# EAGLE design ZaraTraining (EAGLE 9.6.2)
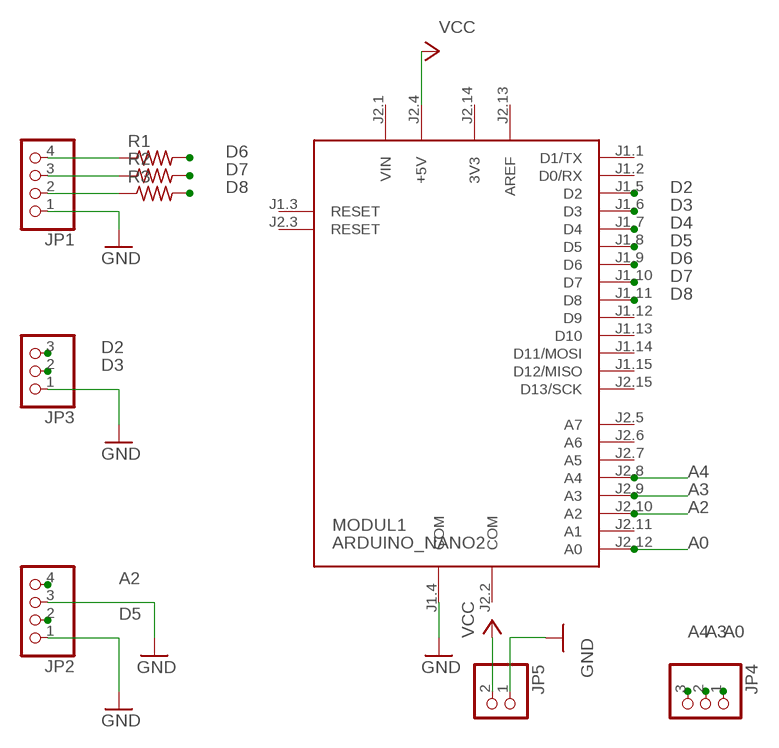
[diagram p0: schematic, sheet 1]

## Parts
JP1  PINHD-1X4  [1X04]
JP2  PINHD-1X4  [1X04]
JP3  PINHD-1X3  [1X03]
JP4  PINHD-1X3  [1X03]
JP5  PINHD-1X2  [1X02]
MODUL1  ARDUINO_NANO2  [ARDUINO_NANO2]
R1  R-US_0204/5  [0204/5]
R2  R-US_0204/5  [0204/5]
R3  R-US_0204/5  [0204/5]

## Nets
A0: JP4.1 MODUL1.J2.12(A0)
A2: JP2.4 MODUL1.J2.10(A2)
A3: JP4.2 MODUL1.J2.9(A3)
A4: JP4.3 MODUL1.J2.8(A4)
D2: JP3.3 MODUL1.J1.5(D2)
D3: JP3.2 MODUL1.J1.6(D3)
D4: MODUL1.J1.7(D4)
D5: JP2.2 MODUL1.J1.8(D5)
D6: MODUL1.J1.9(D6) R1.2
D7: MODUL1.J1.10(D7) R2.2
D8: MODUL1.J1.11(D8) R3.2
GND: JP1.1 JP2.1 JP2.3 JP3.1 JP5.1 MODUL1.J1.4(COM)
N$1: JP1.4 R1.1
N$2: JP1.3 R2.1
N$3: JP1.2 R3.1
VCC: JP5.2 MODUL1.J2.4(+5V)
Unconnected: MODUL1.J1.1(D1/TX) MODUL1.J1.2(D0/RX) MODUL1.J1.3(RESET) MODUL1.J1.12(D9) MODUL1.J1.13(D10) MODUL1.J1.14(D11/MOSI) MODUL1.J1.15(D12/MISO) MODUL1.J2.3(RESET) MODUL1.J2.5(A7) MODUL1.J2.6(A6) MODUL1.J2.7(A5) MODUL1.J2.11(A1) MODUL1.J2.15(D13/SCK)

## Power pins joined to a net without a drawn wire
3V3: MODUL1.J2.14(3V3)
AREF: MODUL1.J2.13(AREF)
COM: MODUL1.J2.2(COM)
VIN: MODUL1.J2.1(VIN)

## Library data of the parts
JP1 JP2 = pinhead:PINHD-1X4: PIN HEADER
JP3 JP4 = pinhead:PINHD-1X3: PIN HEADER
JP5 = pinhead:PINHD-1X2: PIN HEADER
MODUL1 = arduino:ARDUINO_NANO2: Arduino Nano2 Auto generated by modulcreator.ulp \;; ANZAHL: 2; MODUL: TRUE; STECKX0: -76200; STECKX1: 76200; STECKY0: 177800; STECKY1: 177800
R1-R3 = rcl:R-US_: RESISTOR, American symbol; SPICEPREFIX: R

## Board
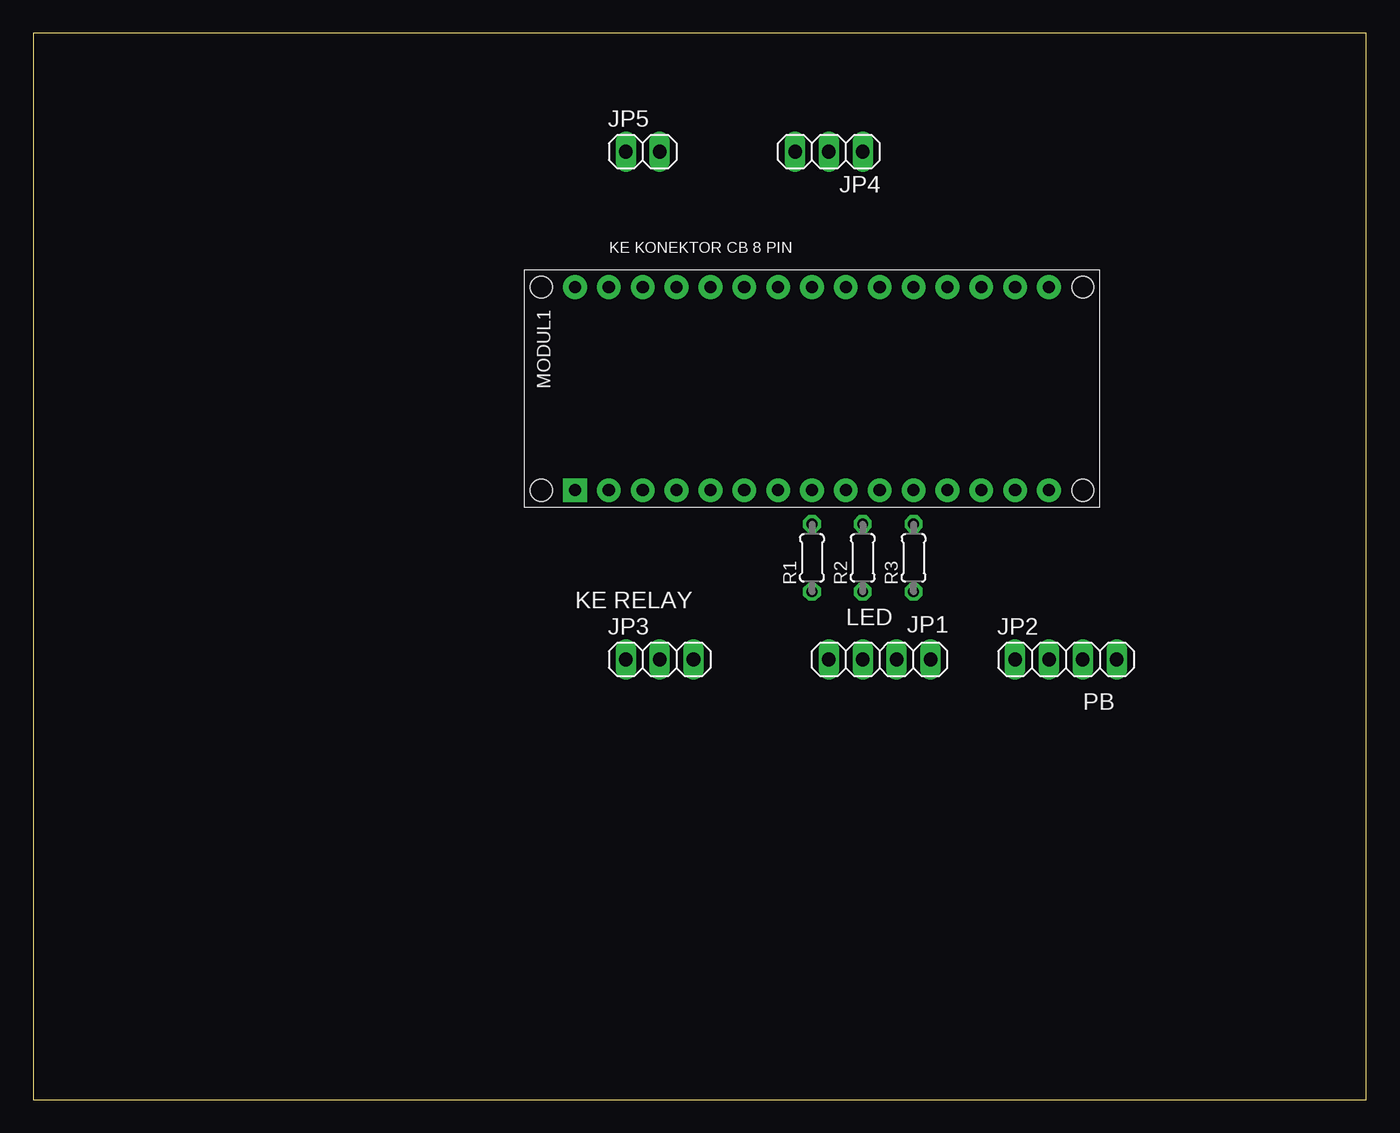
[diagram p1: board, top side]
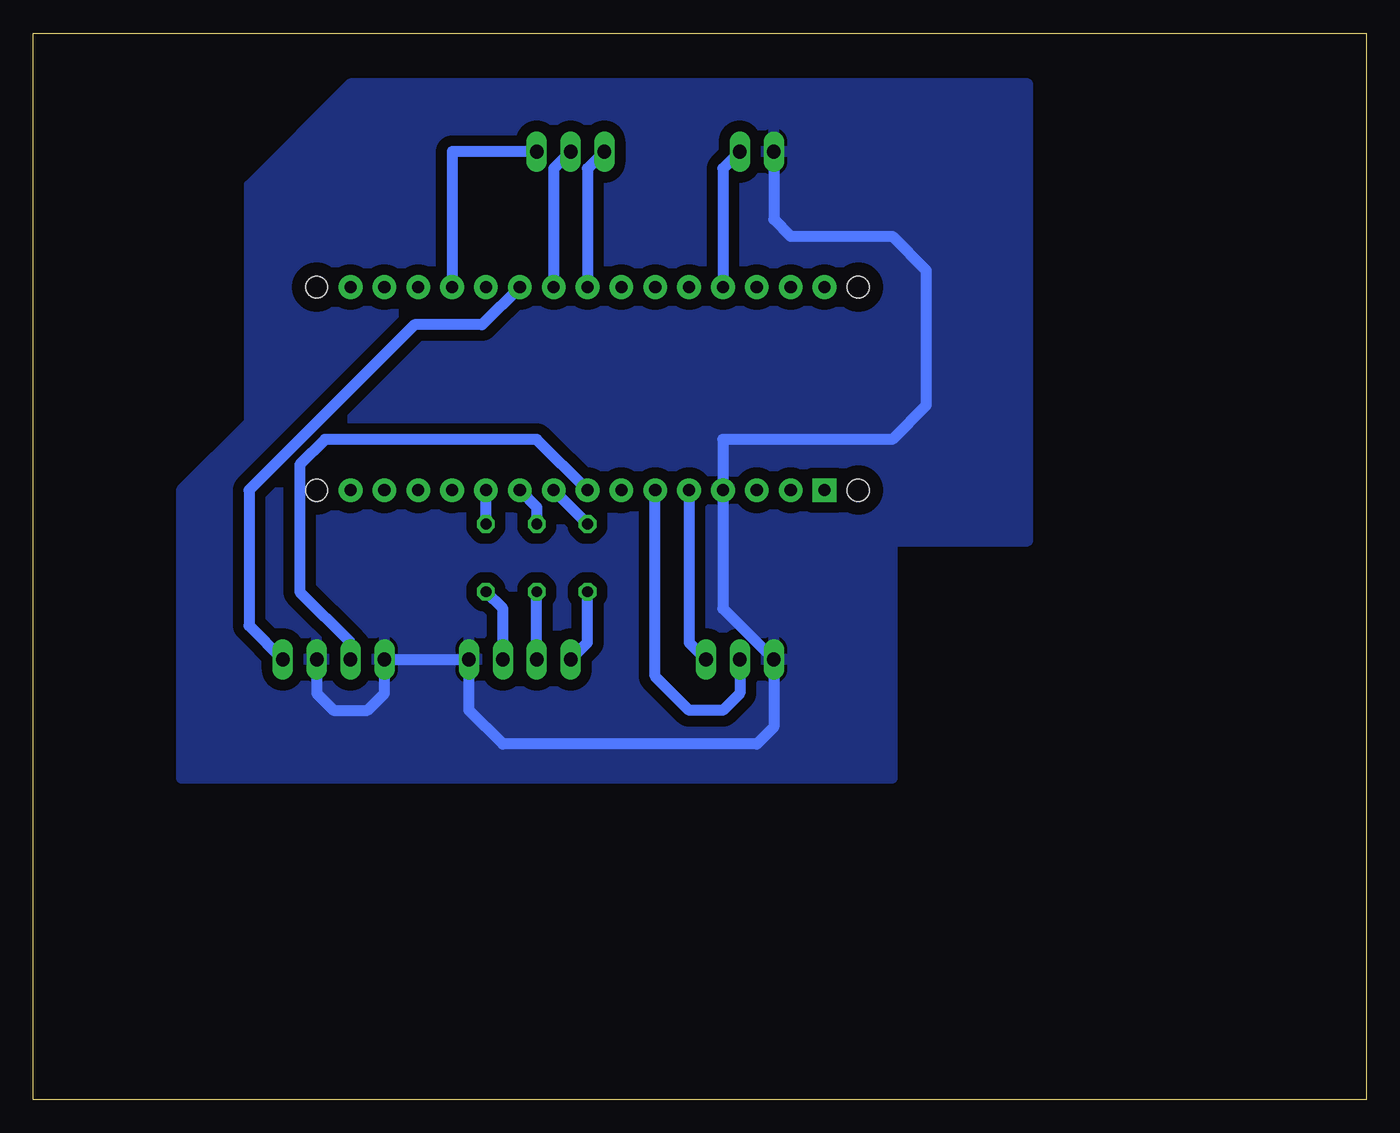
[diagram p2: board, bottom side, seen from below]

Size 100 x 80 mm. Coordinates in mm from the lower left corner, seen from the top.
Outline: 0,0 100,0 100,80 0,80 0,0
Copper layers (1*16): Top 0.035mm / dielectric 1.5mm / Bottom 0.035mm
Design rules "default": minimum track width 6mil, minimum drill 0.35mm, track to track 6mil, track to pad 6mil, pad to pad 6mil, via to via 6mil, smd to smd 6mil, copper to edge 40mil, drill to drill 6mil, minimum pad ring 10mil, minimum via ring 8mil, stop-mask expansion 4mil, vias tented up to drill 0mil, thermal gap 10mil

### Footprints (pad centres in the part's own frame; a part is rotated, then mirrored left to right if it is on the bottom)
1X04 = drill 1.016 long: 1 -3.81,0; 2 -1.27,0; 3 1.27,0; 4 3.81,0
1X03 = drill 1.016 long: 1 -2.54,0; 2 0,0; 3 2.54,0
1X02 = drill 1.016 long: 1 -1.27,0; 2 1.27,0
ARDUINO_NANO2 = drill 0.914 pad 1.778 square: J1.1 -7.62,17.78 | drill 0.914 pad 1.778: J1.2 -7.62,15.24; J1.3 -7.62,12.7; J1.4 -7.62,10.16; J1.5 -7.62,7.62; J1.6 -7.62,5.08; J1.7 -7.62,2.54; J1.8 -7.62,0; J1.9 -7.62,-2.54; J1.10 -7.62,-5.08; J1.11 -7.62,-7.62; J1.12 -7.62,-10.16; J1.13 -7.62,-12.7; J1.14 -7.62,-15.24; J1.15 -7.62,-17.78; J2.1 7.62,17.78; J2.2 7.62,15.24; J2.3 7.62,12.7; J2.4 7.62,10.16; J2.5 7.62,7.62; J2.6 7.62,5.08; J2.7 7.62,2.54; J2.8 7.62,0; J2.9 7.62,-2.54; J2.10 7.62,-5.08; J2.11 7.62,-7.62; J2.12 7.62,-10.16; J2.13 7.62,-12.7; J2.14 7.62,-15.24; J2.15 7.62,-17.78 | hole 1.651: -7.62,-20.32; 7.62,-20.32; 7.62,20.32; -7.62,20.32
0204/5 = drill 0.813 octagon: 1 -2.54,0; 2 2.54,0

### Placement (x,y rotation side)
JP1  63.5,33.02 180 top
JP2  77.47,33.02 0 top
JP3  46.99,33.02 0 top
JP4  59.69,71.12 180 top
JP5  45.72,71.12 0 top
MODUL1  58.42,53.34 90 top
R1  58.42,40.64 90 top
R2  62.23,40.64 90 top
R3  66.04,40.64 90 top

### Tracks (layer width: path | path; a pad name or v marks a point on that pad's centre or on a via)
A0
  Bottom 0.813: JP4.1 68.58,71.12 MODUL1.J2.12
A2
  Bottom 0.813: MODUL1.J2.10 66.33,58.13 71.41,58.13 83.82,45.72 83.82,35.56 JP2.4
A3
  Bottom 0.813: JP4.2 60.96,69.85 MODUL1.J2.9
A4
  Bottom 0.813: JP4.3 58.42,69.85 MODUL1.J2.8
D2
  Bottom 0.813: MODUL1.J1.5 50.8,34.29 JP3.3
D3
  Bottom 0.813: JP3.2 46.99,30.48 48.26,29.21 50.8,29.21 53.34,31.75 MODUL1.J1.6
D5
  Bottom 0.813: MODUL1.J1.8 62.23,49.53 78.11,49.53 80.01,47.63 80.01,38.1 76.2,34.29 JP2.2
D6
  Bottom 0.813: R1.2 MODUL1.J1.9
D7
  Bottom 0.813: MODUL1.J1.10 62.23,44.45 R2.2
D8
  Bottom 0.813: R3.2 MODUL1.J1.11
GND
  Bottom 0.813: JP2.3 78.74,30.48 77.47,29.21 74.93,29.21 73.66,30.48 JP2.1 JP1.1 67.31,29.21 64.77,26.67 45.72,26.67 44.45,27.94 JP3.1 48.26,36.83 MODUL1.J1.4 48.26,49.53 35.56,49.53 33.02,52.07 33.02,62.23 35.56,64.77 43.18,64.77 44.45,66.04 JP5.1
  pour Bottom (isolate 0.813): 33.02,76.2 76.2,76.2 83.82,68.58 83.82,50.8 88.9,45.72 88.9,24.13 35.56,24.13 35.56,41.91 25.4,41.91 25.4,76.2
N$1
  Bottom 0.813: JP1.4 58.42,34.29 R1.1
N$2
  Bottom 0.813: JP1.3 R2.1
N$3
  Bottom 0.813: JP1.2 64.77,36.83 R3.1
VCC
  Bottom 0.813: JP5.2 48.26,69.85 MODUL1.J2.4

### Text on the board
tNames: KE KONEKTOR CB 8 PIN | KE RELAY | LED | PB